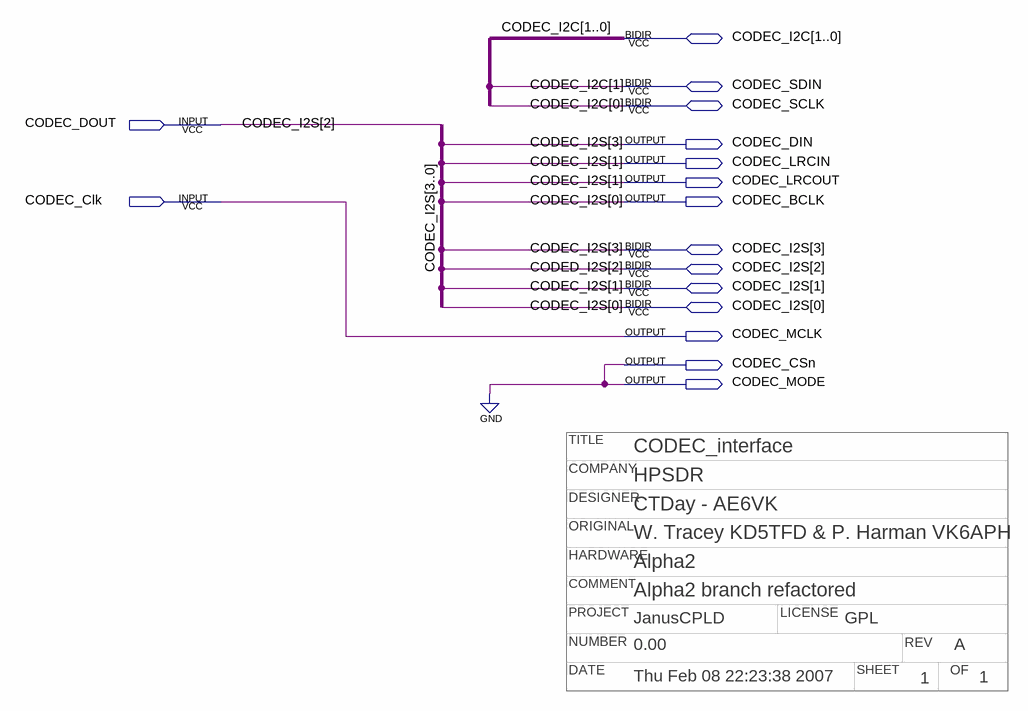
[diagram p0: schematic sheet]
// Quartus schematic CODEC_interface.bdf as structural Verilog: 0 symbols, 16 pins
// Title block: TITLE: CODEC_interface; COMPANY: HPSDR; DESIGNER: CTDay - AE6VK; NUMBER: 0.00; REV: A; DATE: Thu Feb 08 22:23:38 2007; SHEET: 1; OF: 1; ORIGINAL: W. Tracey KD5TFD & P. Harman VK6APH; HARDWARE: Alpha2; COMMENT: Alpha2 branch refactored; PROJECT: JanusCPLD; LICENSE: GPL
module CODEC_interface (
  input  CODEC_DOUT,
  input  CODEC_Clk,
  inout  [1:0] CODEC_I2C,
  inout  CODEC_SDIN,
  inout  CODEC_SCLK,
  inout  [3:0] CODEC_I2S,
  output CODEC_DIN,
  output CODEC_LRCIN,
  output CODEC_LRCOUT,
  output CODEC_BCLK,
  output CODEC_MCLK,
  output CODEC_CSn,
  output CODEC_MODE
);


  assign CODEC_BCLK = CODEC_I2S[0];
  assign CODEC_CSn = 1'b0;
  assign CODEC_DIN = CODEC_I2S[3];
  assign CODEC_I2S[2] = CODEC_DOUT;
  assign CODEC_LRCIN = CODEC_I2S[1];
  assign CODEC_LRCOUT = CODEC_I2S[1];
  assign CODEC_MCLK = CODEC_Clk;
  assign CODEC_MODE = 1'b0;
  assign CODEC_SCLK = CODEC_I2C[0];
  assign CODEC_SDIN = CODEC_I2C[1];

  // Other names for the same wires on the sheet: CODED_I2S[2] = CODEC_DOUT
endmodule
